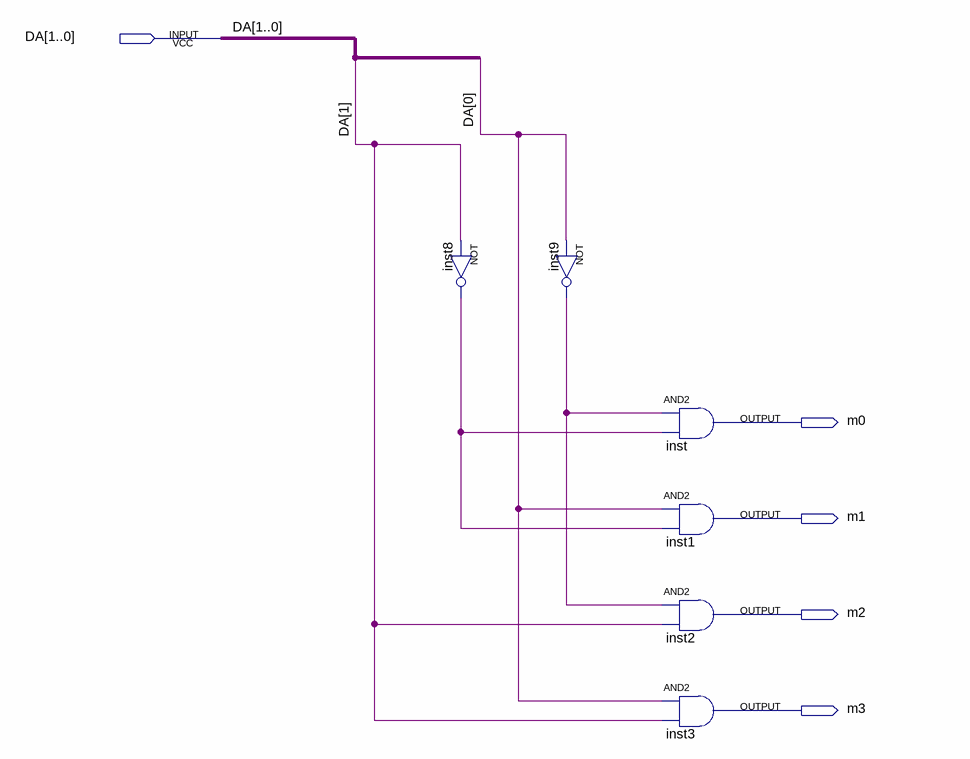
[diagram p0: schematic sheet]
// Quartus schematic 2to4Decoder.bdf as structural Verilog: 6 symbols, 5 pins
module \2to4Decoder  (
  input  [1:0] DA,
  output m0,
  output m1,
  output m2,
  output m3
);

  wire inst8_out, inst9_out;

  not inst8 (inst8_out, DA[1]);
  not inst9 (inst9_out, DA[0]);
  and inst (m0, inst9_out, inst8_out);
  and inst1 (m1, DA[0], inst8_out);
  and inst2 (m2, inst9_out, DA[1]);
  and inst3 (m3, DA[0], DA[1]);
endmodule
